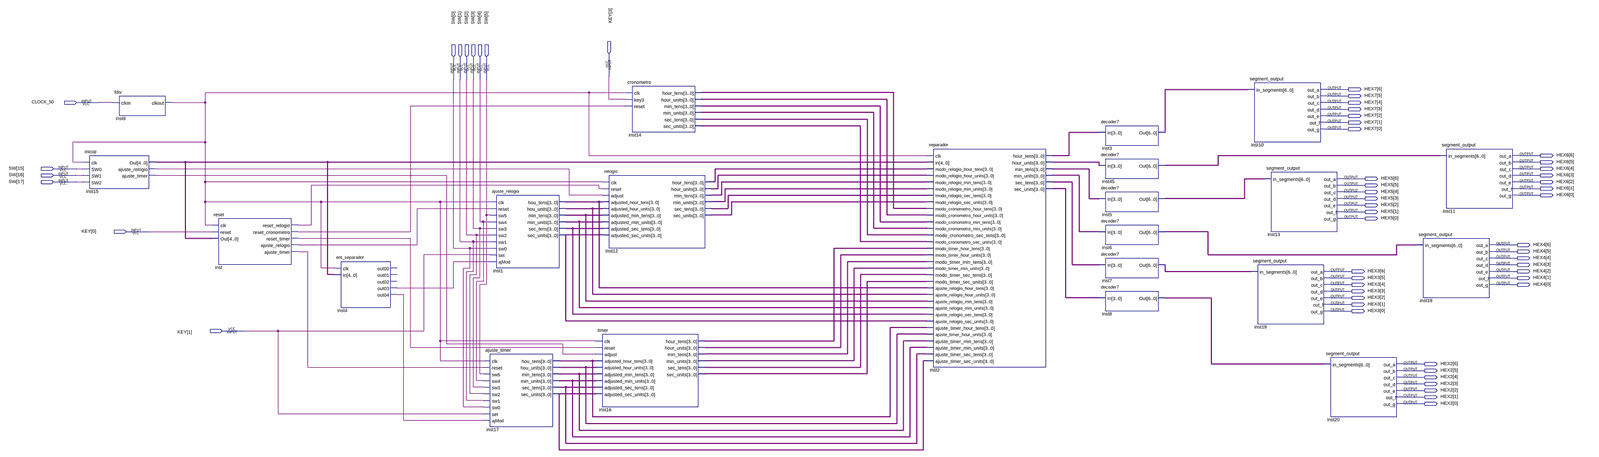
[diagram p0: schematic sheet, whole]
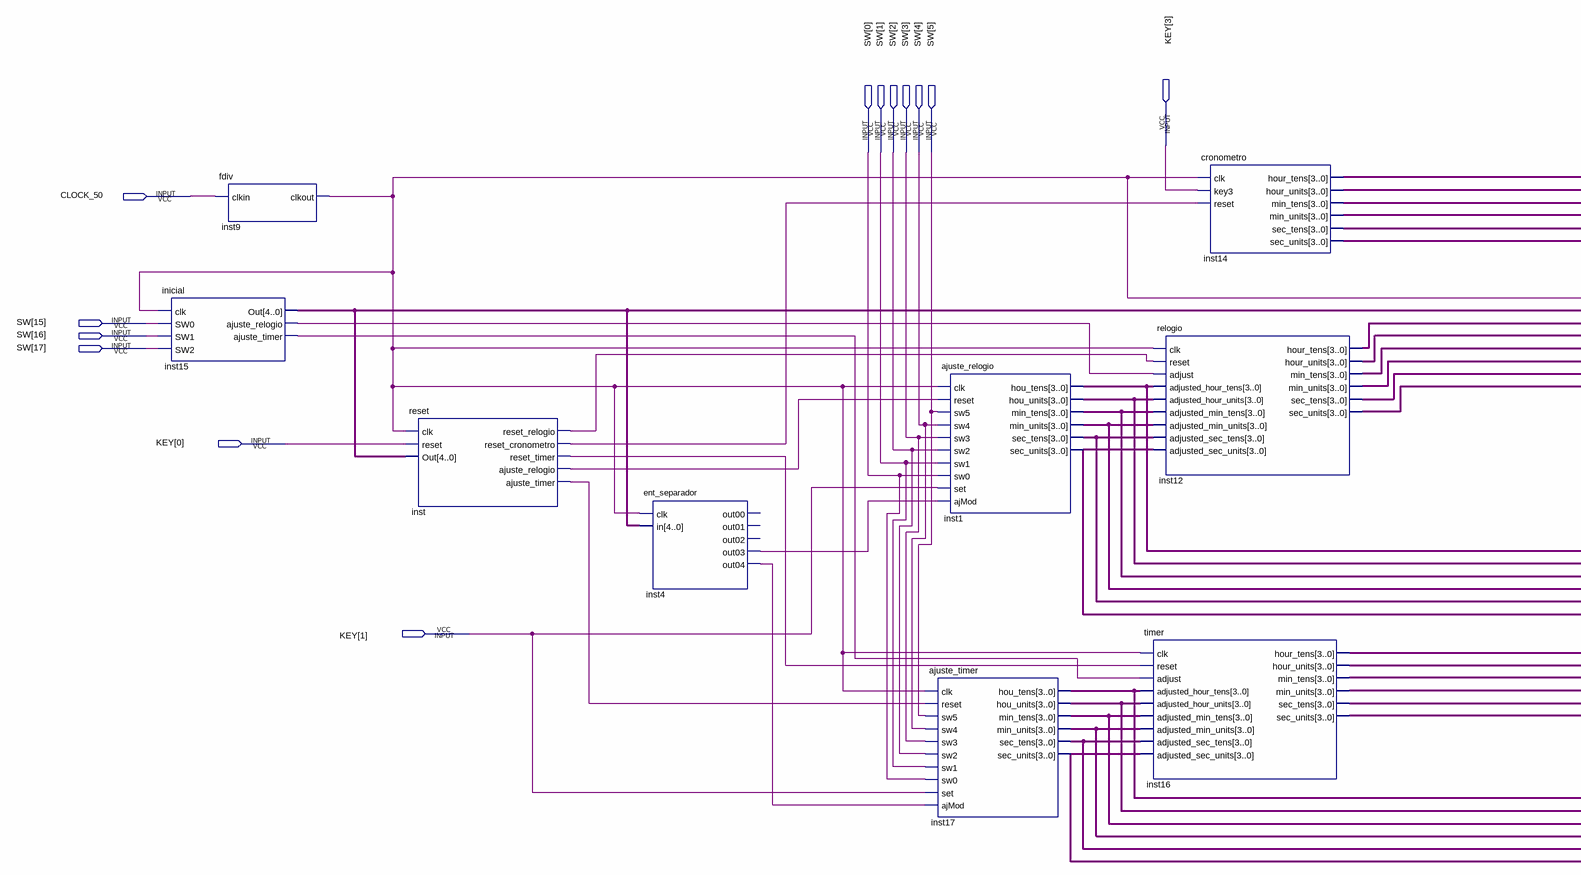
[diagram p1: schematic sheet, left part]
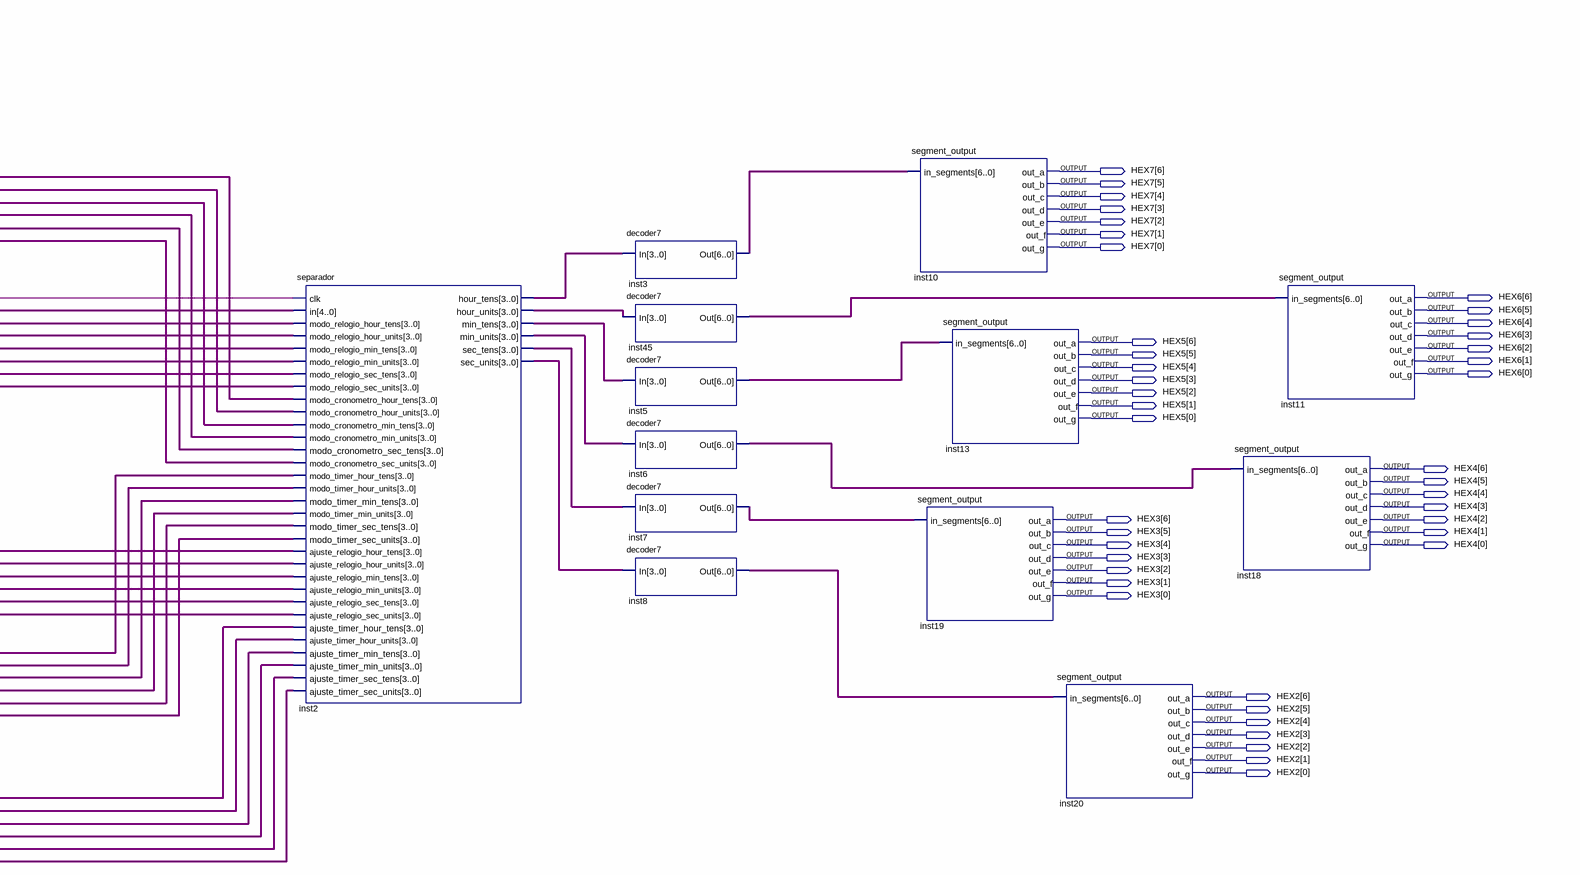
[diagram p2: schematic sheet, right part]
// Quartus schematic PF.bdf as structural Verilog: 22 symbols, 55 pins
module PF (
  input  [3:0] KEY,
  input  [17:0] SW,
  input  CLOCK_50,
  output [6:0] HEX7,
  output [6:0] HEX6,
  output [6:0] HEX5,
  output [6:0] HEX4,
  output [6:0] HEX3,
  output [6:0] HEX2
);

  wire inst4_out03, inst4_out04, inst9_clkout, inst15_ajuste_relogio, inst15_ajuste_timer,
       inst_ajuste_relogio, inst_ajuste_timer, inst_reset_cronometro, inst_reset_relogio, inst_reset_timer;
  wire [3:0] inst1_hou_tens, inst1_hou_units, inst1_min_tens, inst1_min_units, inst1_sec_tens,
       inst1_sec_units, inst2_hour_tens, inst2_hour_units, inst2_min_tens, inst2_min_units, inst2_sec_tens,
       inst2_sec_units, inst12_hour_tens, inst12_hour_units, inst12_min_tens, inst12_min_units,
       inst12_sec_tens, inst12_sec_units, inst14_hour_tens, inst14_hour_units, inst14_min_tens,
       inst14_min_units, inst14_sec_tens, inst14_sec_units, inst16_hour_tens, inst16_hour_units,
       inst16_min_tens, inst16_min_units, inst16_sec_tens, inst16_sec_units, inst17_hou_tens,
       inst17_hou_units, inst17_min_tens, inst17_min_units, inst17_sec_tens, inst17_sec_units;
  wire [4:0] inst15_out;
  wire [6:0] inst3_out, inst5_out, inst6_out, inst7_out, inst8_out, inst45_out;

  inicial inst15 (
    .clk(inst9_clkout), .SW0(SW[15]), .SW1(SW[16]), .SW2(SW[17]), .Out(inst15_out),
    .ajuste_relogio(inst15_ajuste_relogio), .ajuste_timer(inst15_ajuste_timer));
  fdiv inst9 (.clkin(CLOCK_50), .clkout(inst9_clkout));
  reset inst (
    .clk(inst9_clkout), .reset(KEY[0]), .Out(inst15_out), .reset_relogio(inst_reset_relogio),
    .reset_cronometro(inst_reset_cronometro), .reset_timer(inst_reset_timer),
    .ajuste_relogio(inst_ajuste_relogio), .ajuste_timer(inst_ajuste_timer));
  ent_separador inst4 (
    .clk(inst9_clkout), .in(inst15_out), .out03(inst4_out03), .out04(inst4_out04));  // open: out00, out01, out02
  ajuste_relogio inst1 (
    .clk(inst9_clkout), .reset(inst_ajuste_relogio), .sw5(SW[5]), .sw4(SW[4]), .sw3(SW[3]), .sw2(SW[2]),
    .sw1(SW[1]), .sw0(SW[0]), .set(KEY[1]), .ajMod(inst4_out03), .hou_tens(inst1_hou_tens),
    .hou_units(inst1_hou_units), .min_tens(inst1_min_tens), .min_units(inst1_min_units),
    .sec_tens(inst1_sec_tens), .sec_units(inst1_sec_units));
  ajuste_timer inst17 (
    .clk(inst9_clkout), .reset(inst_ajuste_timer), .sw5(SW[5]), .sw4(SW[4]), .sw3(SW[3]), .sw2(SW[2]),
    .sw1(SW[1]), .sw0(SW[0]), .set(KEY[1]), .ajMod(inst4_out04), .hou_tens(inst17_hou_tens),
    .hou_units(inst17_hou_units), .min_tens(inst17_min_tens), .min_units(inst17_min_units),
    .sec_tens(inst17_sec_tens), .sec_units(inst17_sec_units));
  relogio inst12 (
    .clk(inst9_clkout), .reset(inst_reset_relogio), .adjust(inst15_ajuste_relogio),
    .adjusted_hour_tens(inst1_hou_tens), .adjusted_hour_units(inst1_hou_units),
    .adjusted_min_tens(inst1_min_tens), .adjusted_min_units(inst1_min_units),
    .adjusted_sec_tens(inst1_sec_tens), .adjusted_sec_units(inst1_sec_units), .hour_tens(inst12_hour_tens),
    .hour_units(inst12_hour_units), .min_tens(inst12_min_tens), .min_units(inst12_min_units),
    .sec_tens(inst12_sec_tens), .sec_units(inst12_sec_units));
  timer inst16 (
    .clk(inst9_clkout), .reset(inst_reset_timer), .adjust(inst15_ajuste_timer),
    .adjusted_hour_tens(inst17_hou_tens), .adjusted_hour_units(inst17_hou_units),
    .adjusted_min_tens(inst17_min_tens), .adjusted_min_units(inst17_min_units),
    .adjusted_sec_tens(inst17_sec_tens), .adjusted_sec_units(inst17_sec_units), .hour_tens(inst16_hour_tens),
    .hour_units(inst16_hour_units), .min_tens(inst16_min_tens), .min_units(inst16_min_units),
    .sec_tens(inst16_sec_tens), .sec_units(inst16_sec_units));
  cronometro inst14 (
    .clk(inst9_clkout), .key3(KEY[3]), .reset(inst_reset_cronometro), .hour_tens(inst14_hour_tens),
    .hour_units(inst14_hour_units), .min_tens(inst14_min_tens), .min_units(inst14_min_units),
    .sec_tens(inst14_sec_tens), .sec_units(inst14_sec_units));
  separador inst2 (
    .clk(inst9_clkout), .in(inst15_out), .modo_relogio_hour_tens(inst12_hour_tens),
    .modo_relogio_hour_units(inst12_hour_units), .modo_relogio_min_tens(inst12_min_tens),
    .modo_relogio_min_units(inst12_min_units), .modo_relogio_sec_tens(inst12_sec_tens),
    .modo_relogio_sec_units(inst12_sec_units), .modo_cronometro_hour_tens(inst14_hour_tens),
    .modo_cronometro_hour_units(inst14_hour_units), .modo_cronometro_min_tens(inst14_min_tens),
    .modo_cronometro_min_units(inst14_min_units), .modo_cronometro_sec_tens(inst14_sec_tens),
    .modo_cronometro_sec_units(inst14_sec_units), .modo_timer_hour_tens(inst16_hour_tens),
    .modo_timer_hour_units(inst16_hour_units), .modo_timer_min_tens(inst16_min_tens),
    .modo_timer_min_units(inst16_min_units), .modo_timer_sec_tens(inst16_sec_tens),
    .modo_timer_sec_units(inst16_sec_units), .ajuste_relogio_hour_tens(inst1_hou_tens),
    .ajuste_relogio_hour_units(inst1_hou_units), .ajuste_relogio_min_tens(inst1_min_tens),
    .ajuste_relogio_min_units(inst1_min_units), .ajuste_relogio_sec_tens(inst1_sec_tens),
    .ajuste_relogio_sec_units(inst1_sec_units), .ajuste_timer_hour_tens(inst17_hou_tens),
    .ajuste_timer_hour_units(inst17_hou_units), .ajuste_timer_min_tens(inst17_min_tens),
    .ajuste_timer_min_units(inst17_min_units), .ajuste_timer_sec_tens(inst17_sec_tens),
    .ajuste_timer_sec_units(inst17_sec_units), .hour_tens(inst2_hour_tens), .hour_units(inst2_hour_units),
    .min_tens(inst2_min_tens), .min_units(inst2_min_units), .sec_tens(inst2_sec_tens),
    .sec_units(inst2_sec_units));
  decoder7 inst3 (.In(inst2_hour_tens), .Out(inst3_out));
  decoder7 inst45 (.In(inst2_hour_units), .Out(inst45_out));
  decoder7 inst5 (.In(inst2_min_tens), .Out(inst5_out));
  decoder7 inst6 (.In(inst2_min_units), .Out(inst6_out));
  decoder7 inst7 (.In(inst2_sec_tens), .Out(inst7_out));
  decoder7 inst8 (.In(inst2_sec_units), .Out(inst8_out));
  segment_output inst10 (
    .in_segments(inst3_out), .out_a(HEX7[6]), .out_b(HEX7[5]), .out_c(HEX7[4]), .out_d(HEX7[3]),
    .out_e(HEX7[2]), .out_f(HEX7[1]), .out_g(HEX7[0]));
  segment_output inst13 (
    .in_segments(inst5_out), .out_a(HEX5[6]), .out_b(HEX5[5]), .out_c(HEX5[4]), .out_d(HEX5[3]),
    .out_e(HEX5[2]), .out_f(HEX5[1]), .out_g(HEX5[0]));
  segment_output inst19 (
    .in_segments(inst7_out), .out_a(HEX3[6]), .out_b(HEX3[5]), .out_c(HEX3[4]), .out_d(HEX3[3]),
    .out_e(HEX3[2]), .out_f(HEX3[1]), .out_g(HEX3[0]));
  segment_output inst20 (
    .in_segments(inst8_out), .out_a(HEX2[6]), .out_b(HEX2[5]), .out_c(HEX2[4]), .out_d(HEX2[3]),
    .out_e(HEX2[2]), .out_f(HEX2[1]), .out_g(HEX2[0]));
  segment_output inst18 (
    .in_segments(inst6_out), .out_a(HEX4[6]), .out_b(HEX4[5]), .out_c(HEX4[4]), .out_d(HEX4[3]),
    .out_e(HEX4[2]), .out_f(HEX4[1]), .out_g(HEX4[0]));
  segment_output inst11 (
    .in_segments(inst45_out), .out_a(HEX6[6]), .out_b(HEX6[5]), .out_c(HEX6[4]), .out_d(HEX6[3]),
    .out_e(HEX6[2]), .out_f(HEX6[1]), .out_g(HEX6[0]));
endmodule
